# EAGLE schematic NanoEthernet (EAGLE 6.1)
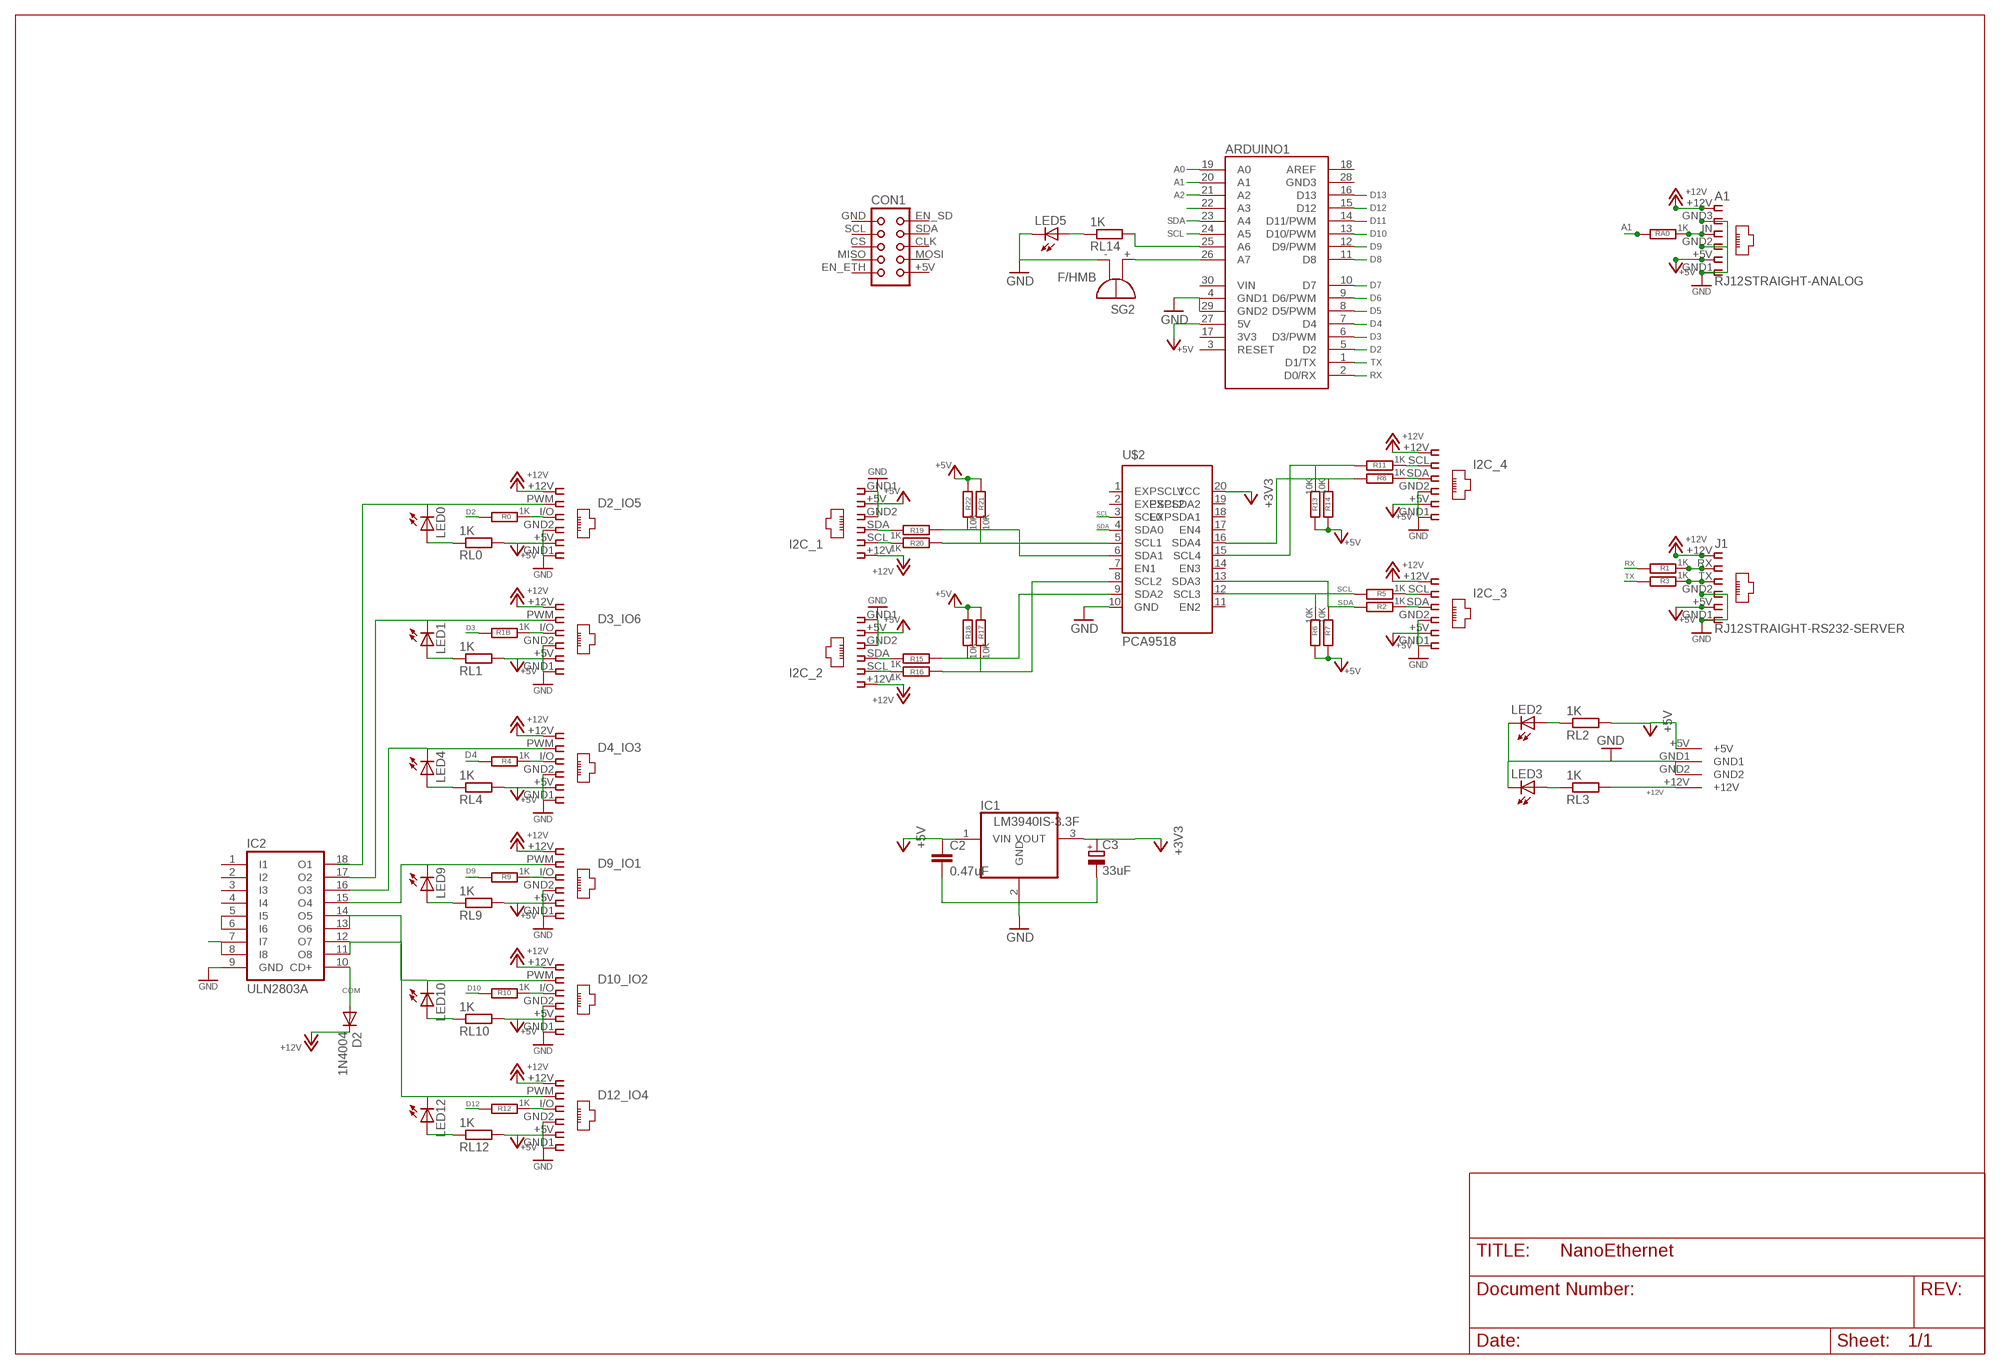
[diagram p0: schematic, sheet 1]

## Parts
A1  RJ12STRAIGHT-ANALOG  [RJ12-STRAIGHT-ANALOG]
ARDUINO1  ARDUINO_NANO  [ARDUINO_NANO]
C2  0.47uF  C-EUC1206  [C1206]
C3  33uF  CPOL-EUE3.5-8  [E3,5-8]
CON1  CON10EXT  [CON10EXT]
D2  1N4004  [DO41-10]
D2_IO5  IO5  RJ12STRAIGHT  [RJ12-STRAIGHT]
D3_IO6  IO6  RJ12STRAIGHT  [RJ12-STRAIGHT]
D4_IO3  IO3  RJ12STRAIGHT  [RJ12-STRAIGHT]
D9_IO1  IO1  RJ12STRAIGHT  [RJ12-STRAIGHT]
D10_IO2  IO2  RJ12STRAIGHT  [RJ12-STRAIGHT]
D12_IO4  IO4  RJ12STRAIGHT  [RJ12-STRAIGHT]
I2C_1  I2C  RJ12STRAIGHT-I2C  [RJ12-STRAIGHT-I2C]
I2C_2  I2C  RJ12STRAIGHT-I2C  [RJ12-STRAIGHT-I2C]
I2C_3  I2C  RJ12STRAIGHT-I2C  [RJ12-STRAIGHT-I2C]
I2C_4  I2C  RJ12STRAIGHT-I2C  [RJ12-STRAIGHT-I2C]
IC1  LM3940IS-3.3F  [DD-3]
IC2  ULN2803A  [SO18W]
J1  RJ12STRAIGHT-RS232-SERVER  [RJ12-STRAIGHT-RS232]
LED0  LED3MM  [LED3MM]
LED1  LED3MM  [LED3MM]
LED2  LED3MM  [LED3MM]
LED3  LED3MM  [LED3MM]
LED4  LED3MM  [LED3MM]
LED5  LED3MM  [LED3MM]
LED9  LED3MM  [LED3MM]
LED10  LED3MM  [LED3MM]
LED12  LED3MM  [LED3MM]
R0  1K  R-EU_M1206  [M1206]
R1  1K  R-EU_M1206  [M1206]
R1B  1K  R-EU_M1206  [M1206]
R2  1K  R-EU_M1206  [M1206]
R3  1K  R-EU_M1206  [M1206]
R4  1K  R-EU_M1206  [M1206]
R5  1K  R-EU_M1206  [M1206]
R6  10K  R-EU_M1206  [M1206]
R7  10K  R-EU_M1206  [M1206]
R8  1K  R-EU_M1206  [M1206]
R9  1K  R-EU_M1206  [M1206]
R10  1K  R-EU_M1206  [M1206]
R11  1K  R-EU_M1206  [M1206]
R12  1K  R-EU_M1206  [M1206]
R13  10K  R-EU_M1206  [M1206]
R14  10K  R-EU_M1206  [M1206]
R15  1K  R-EU_M1206  [M1206]
R16  1K  R-EU_M1206  [M1206]
R17  10K  R-EU_M1206  [M1206]
R18  10K  R-EU_M1206  [M1206]
R19  1K  R-EU_M1206  [M1206]
R20  1K  R-EU_M1206  [M1206]
R21  10K  R-EU_M1206  [M1206]
R22  10K  R-EU_M1206  [M1206]
RA0  1K  R-EU_M1206  [M1206]
RL0  1K  R-EU_M1206  [M1206]
RL1  1K  R-EU_M1206  [M1206]
RL2  1K  R-EU_M1206  [M1206]
RL3  1K  R-EU_M1206  [M1206]
RL4  1K  R-EU_M1206  [M1206]
RL9  1K  R-EU_M1206  [M1206]
RL10  1K  R-EU_M1206  [M1206]
RL12  1K  R-EU_M1206  [M1206]
RL14  1K  R-EU_M1206  [M1206]
SG2  F/HMB  [F/HMB]
U$1  KPJX-4S-S  [KPJX-4S-S]
U$2  PCA9518  [SO20W]

## Nets
+3V3: C3.+ IC1.3(VOUT) U$2.20(VCC)
+5V [highpower]: A1.+5V ARDUINO1.27(5V) C2.1 D2_IO5.+5V D3_IO6.+5V D4_IO3.+5V D9_IO1.+5V D10_IO2.+5V D12_IO4.+5V I2C_1.+5V I2C_2.+5V I2C_3.+5V I2C_4.+5V IC1.1(VIN) J1.+5V R6.2 R7.2 R13.2 R14.2 R17.2 R18.2 R21.2 R22.2 RL0.2 RL1.2 RL2.2 RL4.2 RL9.2 RL10.2 RL12.2 U$1.+5V
+12V [highpower]: A1.+12V D2.C D2_IO5.+12V D3_IO6.+12V D4_IO3.+12V D9_IO1.+12V D10_IO2.+12V D12_IO4.+12V I2C_1.+12V I2C_2.+12V I2C_3.+12V I2C_4.+12V J1.+12V RL3.2 U$1.+12V
A0: ARDUINO1.19(A0)
A1: ARDUINO1.20(A1) RA0.2
A2: ARDUINO1.21(A2)
COM: D2.A IC2.10(CD+)
D2: ARDUINO1.5(D2) R0.2
D2B: D4_IO3.I/O R4.1
D2B1: D9_IO1.I/O R9.1
D2B2: D10_IO2.I/O R10.1
D2B3: D12_IO4.I/O R12.1
D2B4: I2C_3.SDA R2.1
D2B5: J1.TX R3.1
D2B6: D2_IO5.I/O R0.1
D2B7: D3_IO6.I/O R1B.1
D2B8: A1.IN RA0.1
D2B10: I2C_4.SDA R8.1
D2B11: I2C_2.SDA R15.1
D2B12: I2C_1.SDA R19.1
D3: ARDUINO1.6(D3/PWM) R1B.2
D4: ARDUINO1.7(D4) R4.2
D5: ARDUINO1.8(D5/PWM)
D6: ARDUINO1.9(D6/PWM)
D7: ARDUINO1.10(D7)
D8: ARDUINO1.11(D8)
D9: ARDUINO1.12(D9/PWM) R9.2
D10: ARDUINO1.13(D10/PWM) IC2.5(I5) IC2.6(I6) R10.2
D11: ARDUINO1.14(D11/PWM)
D12: ARDUINO1.15(D12) IC2.7(I7) IC2.8(I8) R12.2
D13: ARDUINO1.16(D13)
GND [highpower]: A1.GND1 A1.GND2 A1.GND3 ARDUINO1.4(GND1) ARDUINO1.29(GND2) C2.2 C3.- D2_IO5.GND1 D2_IO5.GND2 D3_IO6.GND1 D3_IO6.GND2 D4_IO3.GND1 D4_IO3.GND2 D9_IO1.GND1 D9_IO1.GND2 D10_IO2.GND1 D10_IO2.GND2 D12_IO4.GND1 D12_IO4.GND2 I2C_1.GND1 I2C_1.GND2 I2C_2.GND1 I2C_2.GND2 I2C_3.GND1 I2C_3.GND2 I2C_4.GND1 I2C_4.GND2 IC1.2(GND) IC2.9(GND) J1.GND1 J1.GND2 LED2.K(C) LED3.K(C) LED5.K(C) SG2.- U$1.GND1 U$1.GND2 U$2.10(GND)
N$1: I2C_4.SCL R11.1
N$2: R11.2 R13.1 U$2.15(SCL4)
N$3: R8.2 R14.1 U$2.16(SDA4)
N$5: I2C_2.SCL R16.1
N$6: R16.2 R17.1 U$2.8(SCL2)
N$7: J1.RX R1.1
N$8: I2C_3.SCL R5.1
N$9: R15.2 R18.1 U$2.9(SDA2)
N$10: LED5.A RL14.1
N$11: I2C_1.SCL R20.1
N$12: LED9.A RL9.1
N$13: LED3.A RL3.1
N$14: R20.2 R21.1 U$2.5(SCL1)
N$15: LED4.A RL4.1
N$16: ARDUINO1.22(A3)
N$17: R19.2 R22.1 U$2.6(SDA1)
N$18 [power]: D4_IO3.PWM IC2.16(O3) LED4.K(C)
N$20: ARDUINO1.25(A6) RL14.2
N$21: LED10.A RL10.1
N$22: ARDUINO1.26(A7) SG2.+
N$23: LED2.A RL2.1
N$24 [power]: D10_IO2.PWM IC2.13(O6) IC2.14(O5) LED10.K(C)
N$28: LED12.A RL12.1
N$35 [power]: D3_IO6.PWM IC2.17(O2) LED1.K(C)
N$38: LED0.A RL0.1
N$40 [power]: D2_IO5.PWM LED0.K(C)
N$41: LED1.A RL1.1
N$42 [power]: D9_IO1.PWM IC2.15(O4) LED9.K(C)
N$44 [power]: D12_IO4.PWM IC2.11(O8) IC2.12(O7) LED12.K(C)
RX: ARDUINO1.2(D0/RX) R1.2
SCL: ARDUINO1.24(A5) R5.2 R6.1 U$2.3(SCL0) U$2.12(SCL3)
SDA: ARDUINO1.23(A4) R2.2 R7.1 U$2.4(SDA0) U$2.13(SDA3)
TX: ARDUINO1.1(D1/TX) R3.2
Unconnected: ARDUINO1.3(RESET) ARDUINO1.18(AREF) ARDUINO1.28(GND3) ARDUINO1.30(VIN) CON1.+5V CON1.CLK CON1.CS CON1.EN_ETH CON1.EN_SD CON1.GND CON1.MISO CON1.MOSI CON1.SCL CON1.SDA IC2.1(I1) IC2.2(I2) IC2.3(I3) IC2.4(I4) IC2.18(O1) U$2.1(EXPSCL1) U$2.2(EXPSCL2) U$2.7(EN1) U$2.11(EN2) U$2.14(EN3) U$2.17(EN4) U$2.18(EXPSDA1) U$2.19(EXPSDA2)

## Power pins joined to a net without a drawn wire
3V3: ARDUINO1.17(3V3)

## Library data of the parts
A1 D2_IO5 D3_IO6 D4_IO3 D9_IO1 D10_IO2 D12_IO4 I2C_1-I2C_4 J1 = lpatiny:RJ12: CORCOM Modular RJ Jacks No Shield Source: www.tycoelectronics.com .. ENG_DS_1654001_1099_RJ_L_0507.pdf
ARDUINO1 = arduino:ARDUINO_NANO: Arduino Nano I/O pin arrangement
C2 = rcl:C-EU: CAPACITOR, European symbol
C3 = rcl:CPOL-EU: POLARIZED CAPACITOR, European symbol
CON1 = lpatiny:CON10: CONNECTOR; OC_FARNELL: unknown; OC_NEWARK: unknown
D2 = diode:1N4004: DIODE general purpose rectifier, 1 A
IC1 = lpatiny:LM3940IS-3.3: 1A Low Dropout (LDO) for 5V to 3.3V conversion; MF: TEXAS INSTRUMENTS; MPN: REG1117FAKTTT; OC_FARNELL: 1296120; OC_NEWARK: 87H2562
IC2 = lpatiny:ULN2803A: DRIVER ARRAY
LED0 LED1-LED5 LED9 LED10 LED12 = lpatiny:LED3MM
R0 R1 R1B R2-R22 RA0 RL0 RL1-RL4 RL9 RL10 RL12 RL14 = resistor:R-EU_: RESISTOR, European symbol
SG2 = buzzer:F/HMB: BUZZER Source: Buerklin; OC_FARNELL: unknown; OC_NEWARK: unknown
U$1 = lpatiny:KPJX-4S-S
U$2 = lpatiny:PCA9518

## Net classes
0 default: width 0.457 mm
1 power: width 0.914 mm
2 highpower: width 1.372 mm